# EAGLE schematic PPS1_schemas_V2 (EAGLE 9.6.2)
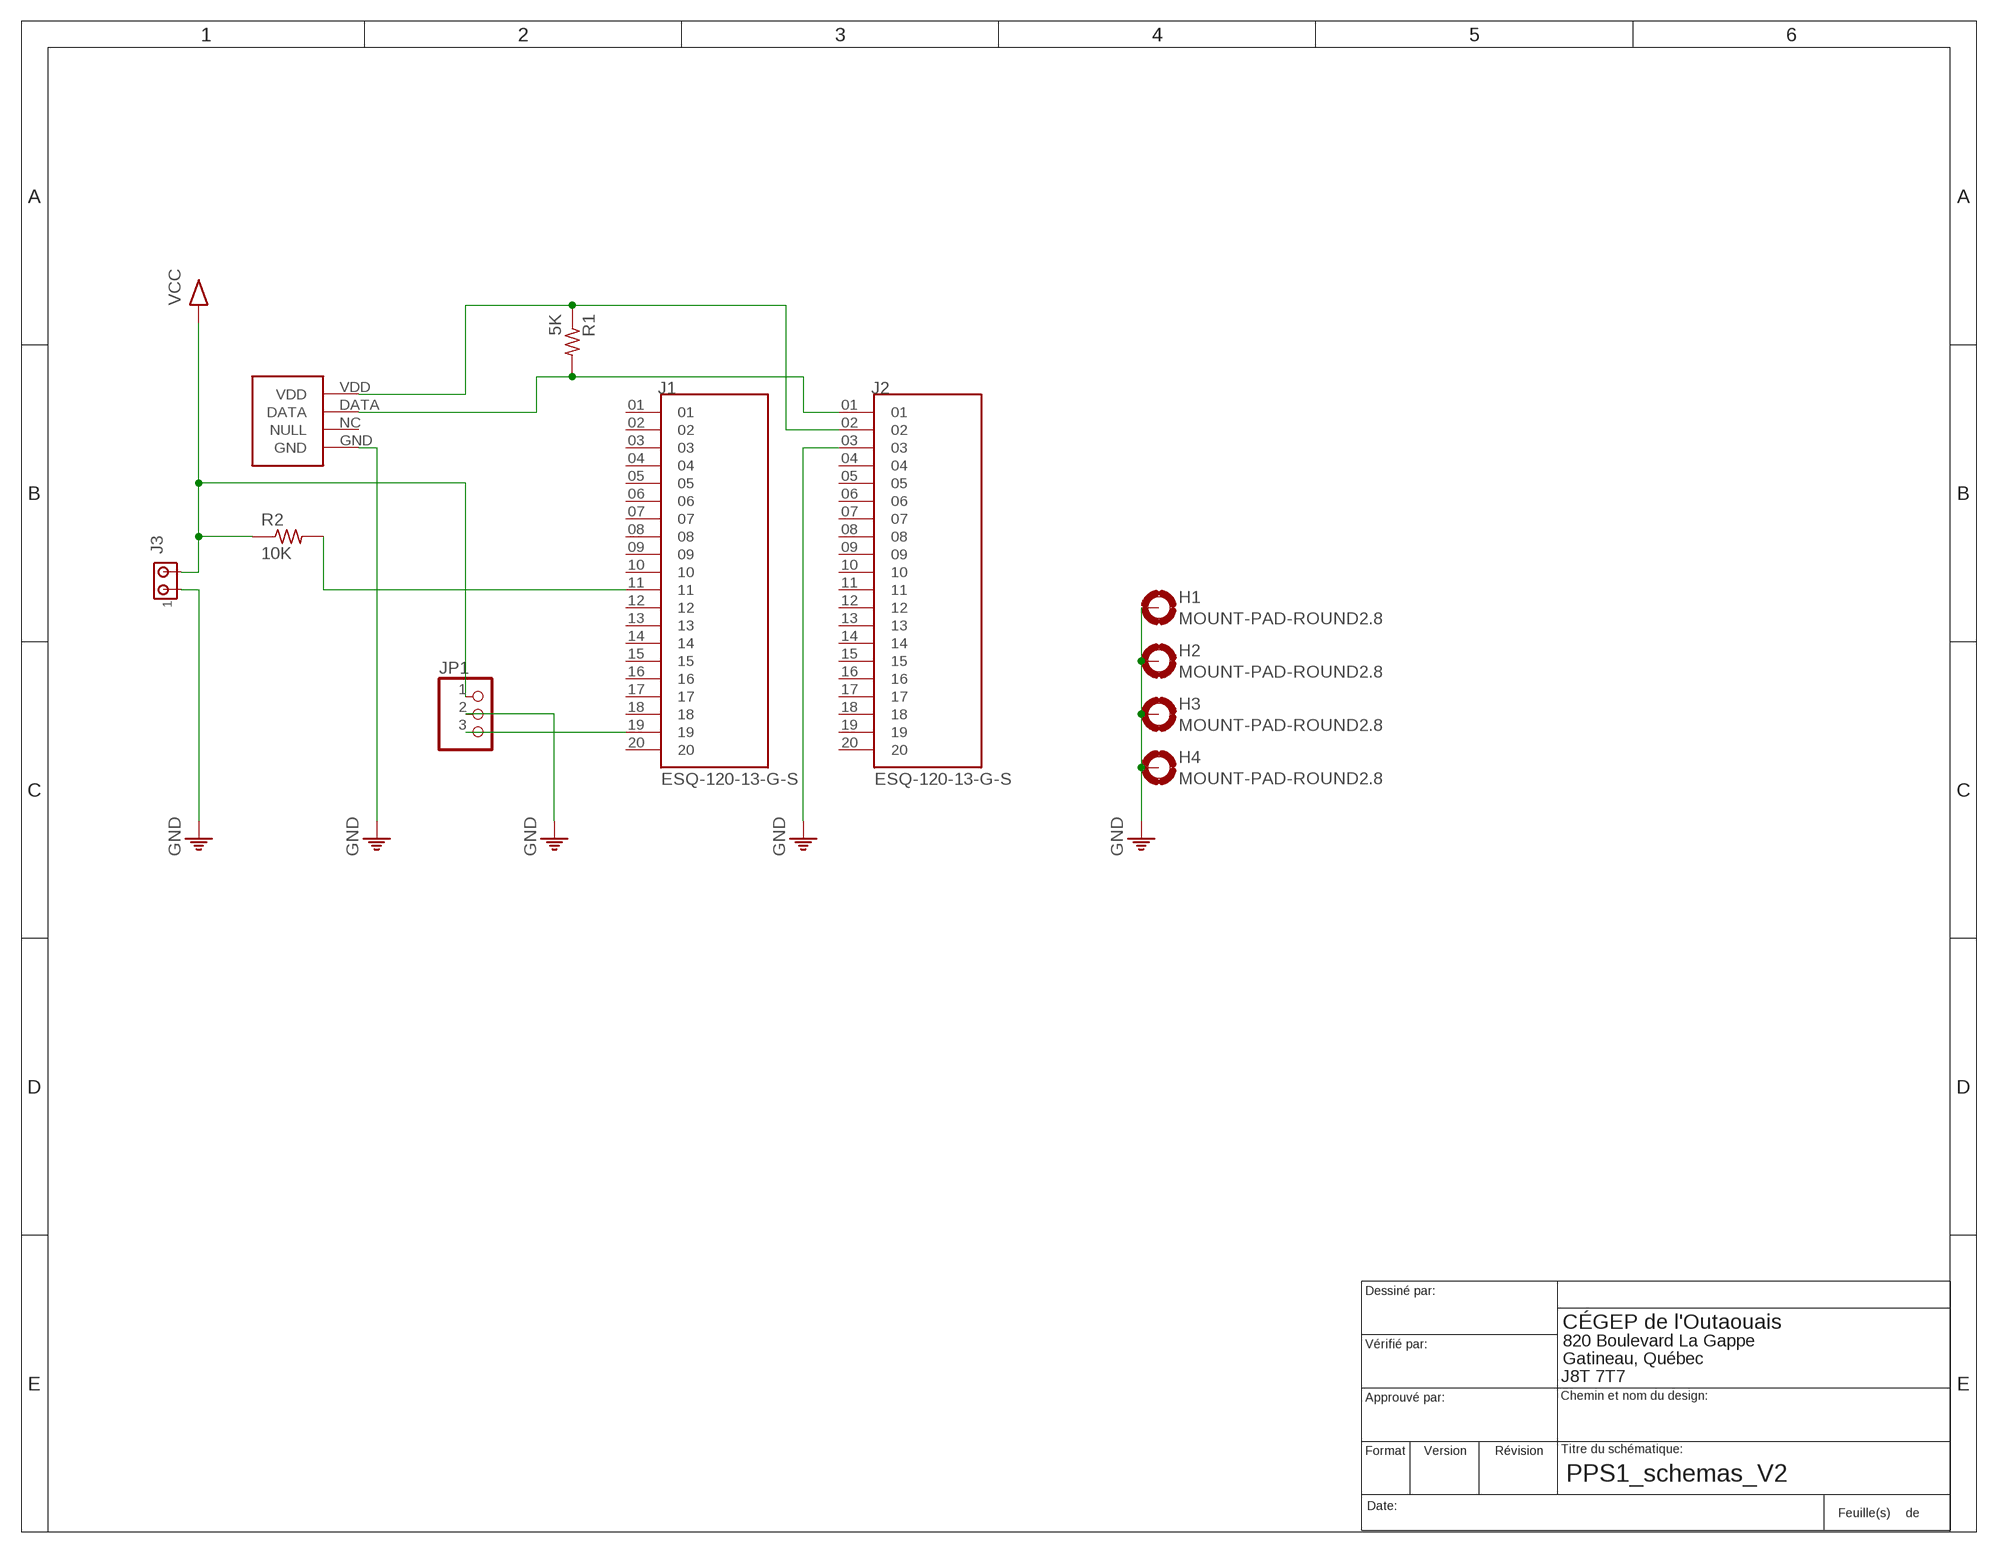
[diagram p0: schematic, sheet 1]

## Parts
H1  MOUNT-PAD-ROUND2.8  [2,8-PAD]
H2  MOUNT-PAD-ROUND2.8  [2,8-PAD]
H3  MOUNT-PAD-ROUND2.8  [2,8-PAD]
H4  MOUNT-PAD-ROUND2.8  [2,8-PAD]
J1  ESQ-120-13-G-S  [SAMTEC_ESQ-120-13-G-S]
J2  ESQ-120-13-G-S  [SAMTEC_ESQ-120-13-G-S]
J3  MTA02-100  [10X02MTA]
JP1  PINHD-1X3  [1X03]
R1  5K  RM1206  [M1206]
R2  10K  RM1206  [M1206]
U$1  DHT22  [DHT22]

## Nets
N$1: J2.01 R1.2 U$1.DATA
N$2: J2.02 R1.1 U$1.VDD
N$4: J1.11 R2.2
N$5: J1.19 JP1.3
PE: H1.B2,8(MOUNT) H2.B2,8(MOUNT) H3.B2,8(MOUNT) H4.B2,8(MOUNT) J2.03 J3.1 JP1.2 U$1.GND ; supply symbol labelled GND
VCC: J3.2 JP1.1 R2.1
Unconnected: J1.01 J1.02 J1.03 J1.04 J1.05 J1.06 J1.07 J1.08 J1.09 J1.10 J1.12 J1.13 J1.14 J1.15 J1.16 J1.17 J1.18 J1.20 J2.04 J2.05 J2.06 J2.07 J2.08 J2.09 J2.10 J2.11 J2.12 J2.13 J2.14 J2.15 J2.16 J2.17 J2.18 J2.19 J2.20 U$1.NC(NULL)

## Library data of the parts
H1-H4 = holes:MOUNT-PAD-ROUND: MOUNTING PAD, round
J1 J2 = 20x1_connector:ESQ-120-13-G-S: Check availability <https://pricing.snapeda.com/parts/ESQ-120-13-G-S/Samtec/view-part?ref=eda>; AVAILABILITY: In Stock; CHECK_PRICES: https://www.snapeda.com/parts/ESQ-120-13-G-S/Samtec/view-part/?ref=eda; DESCRIPTION: 20 Position Elevated Socket Connector 0.100 (2.54mm) Through Hole Gold; MF: Samtec; MP: ESQ-120-13-G-S; PACKAGE: None; PRICE: None; SNAPEDA_LINK: https://www.snapeda.com/parts/ESQ-120-13-G-S/Samtec/view-part/?ref=snap
J3 = con-amp:MTA02-100: AMP connector
JP1 = pinhead:PINHD-1X3: PIN HEADER
R1 R2 = 2_TGE-sur G:R: R
U$1 = DHT22:DHT22: Check availability <https://pricing.snapeda.com/parts/DHT22/Aosong%20Electronics/view-part?ref=eda>; AVAILABILITY: Not in stock; CHECK_PRICES: https://www.snapeda.com/parts/DHT22/Aosong+Electronics/view-part/?ref=eda; DESCRIPTION: Capacitive-type humidity and temperature module/sensor; MF: Aosong Electronics; MP: DHT22; PACKAGE: Package; PRICE: None; SNAPEDA_LINK: https://www.snapeda.com/parts/DHT22/Aosong+Electronics/view-part/?ref=snap